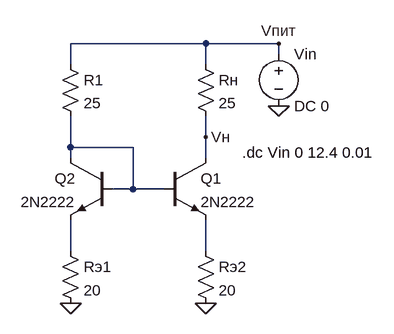
[diagram p0: schematic scheme1.asc]
scheme1.asc, the LTspice schematic file:
Version 4.1
SHEET 1 880 680
WIRE 240 80 32 80
WIRE 352 80 240 80
WIRE 352 96 352 80
WIRE 32 112 32 80
WIRE 240 112 240 80
WIRE 240 224 240 192
WIRE 32 240 32 192
WIRE 128 240 32 240
WIRE 32 256 32 240
WIRE 240 256 240 224
WIRE 128 304 128 240
WIRE 128 304 96 304
WIRE 176 304 128 304
WIRE 32 400 32 352
WIRE 240 400 240 352
FLAG 352 176 0
FLAG 32 480 0
FLAG 240 480 0
FLAG 240 224 Vн
FLAG 352 80 Vпит
SYMBOL res 16 96 R0
SYMATTR InstName R1
SYMATTR Value 25
SYMBOL res 224 96 R0
SYMATTR InstName Rн
SYMATTR Value 25
SYMBOL res 16 384 R0
SYMATTR InstName Rэ1
SYMATTR Value 20
SYMBOL res 224 384 R0
SYMATTR InstName Rэ2
SYMATTR Value 20
SYMBOL voltage 352 80 R0
SYMATTR InstName Vin
SYMATTR Value DC 0
SYMBOL npn 176 256 R0
SYMATTR InstName Q1
SYMATTR Value 2N2222
SYMBOL npn 96 256 M0
SYMATTR InstName Q2
SYMATTR Value 2N2222
TEXT 296 248 Left 2 !.dc Vin 0 12.4 0.01

The netlist it stands for:
* scheme1.asc
R1 Vпит N001 25
Rн Vпит Vн 25
Rэ1 N002 0 20
Rэ2 N003 0 20
Vin Vпит 0 DC 0
Q1 Vн N001 N003 0 2N2222
Q2 N001 N001 N002 0 2N2222
.model NPN NPN
.model PNP PNP
.lib standard.bjt
.dc Vin 0 12.4 0.01
.backanno
.end